# EAGLE design VestibularH2 (EAGLE 9.6.2)
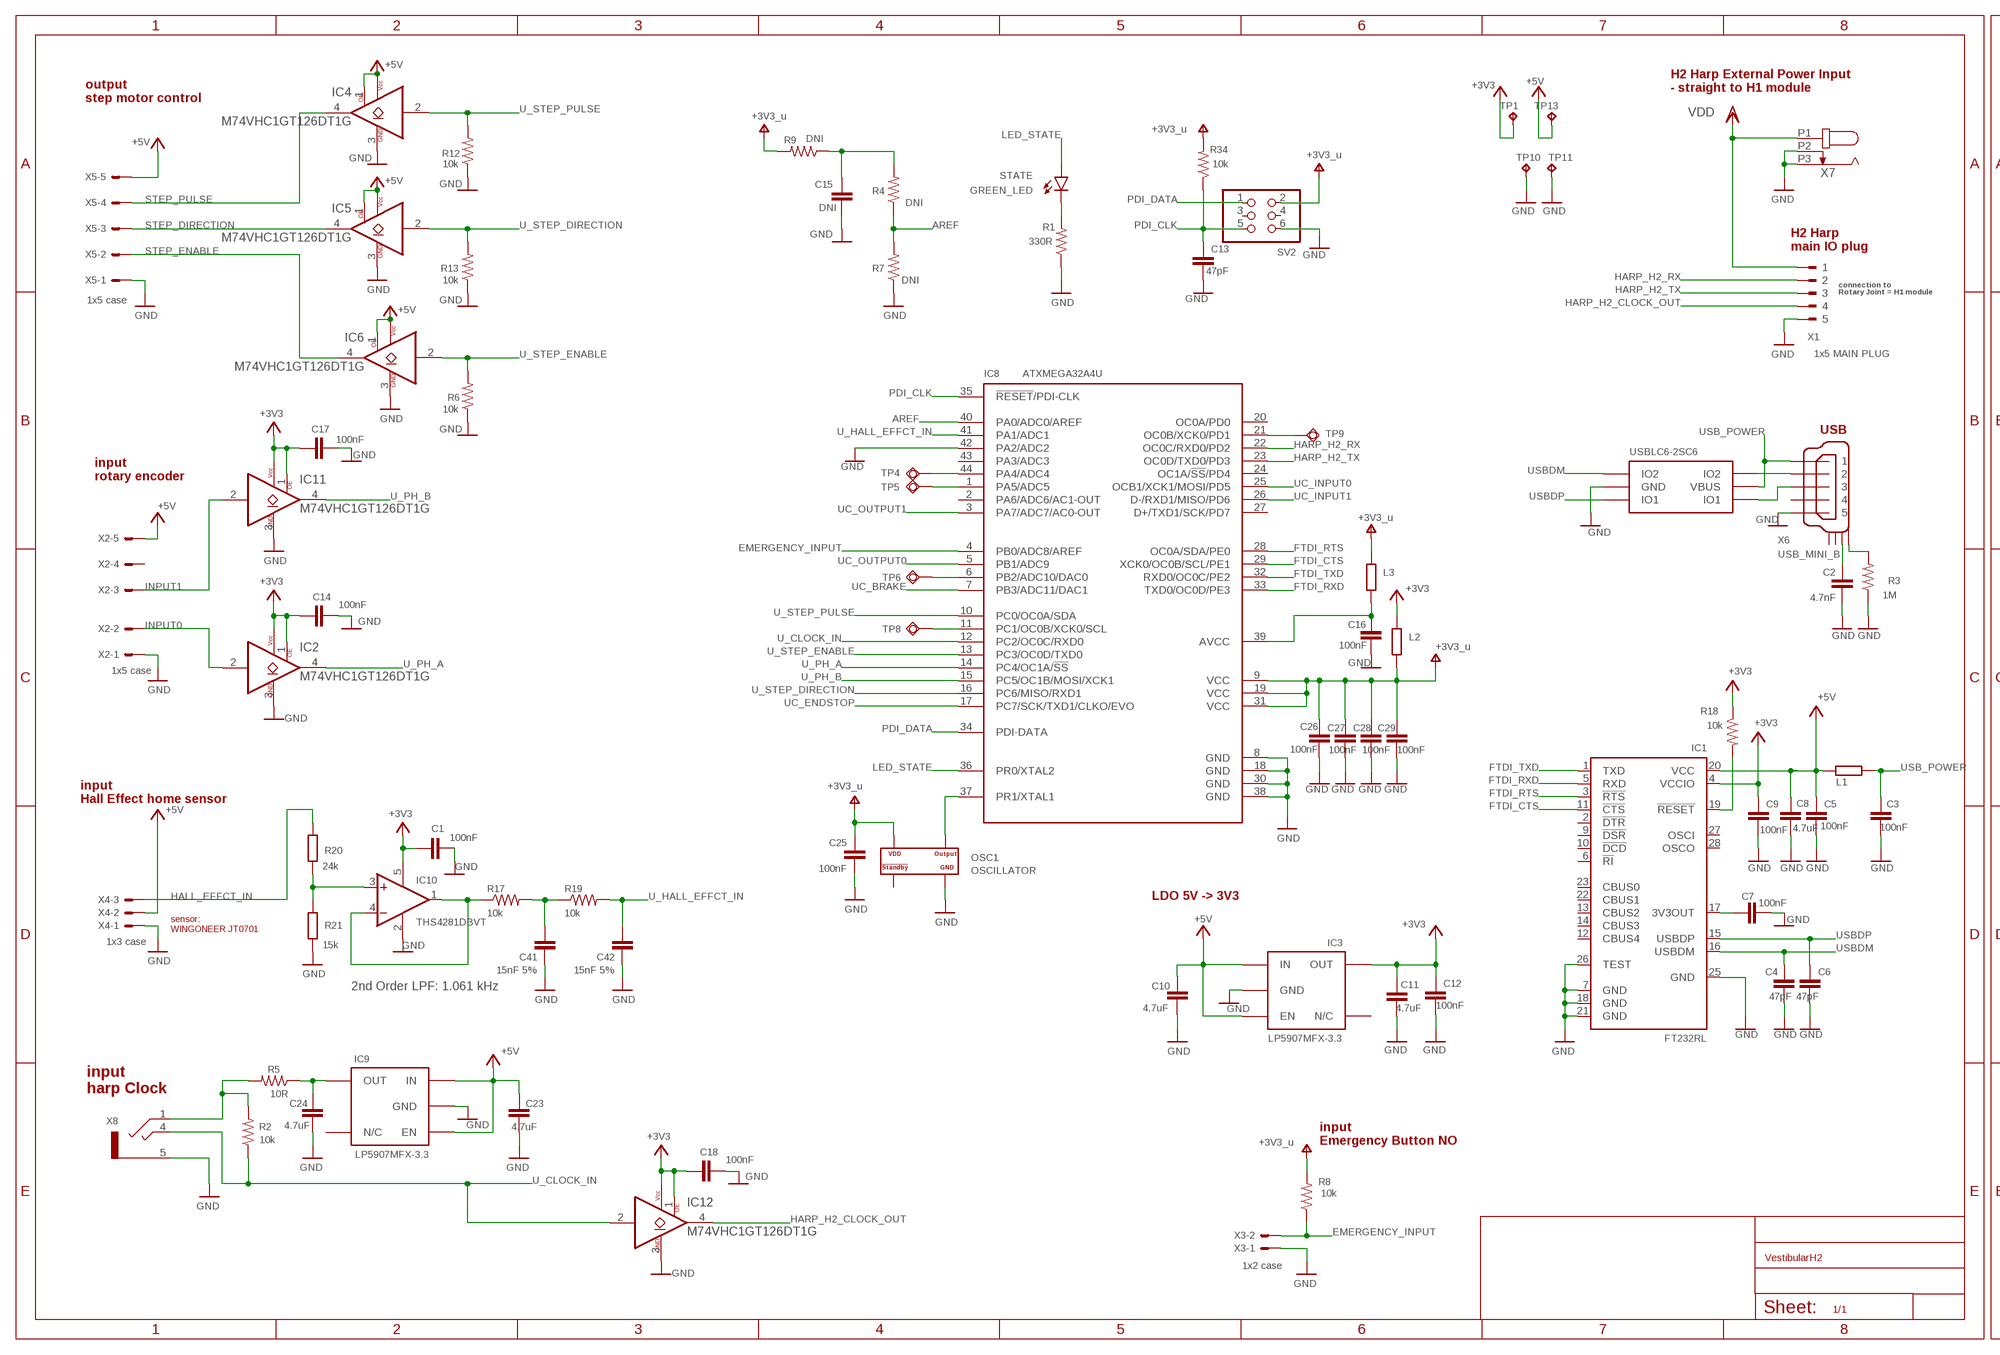
[diagram p0: schematic, sheet 1, part 1 of 2]
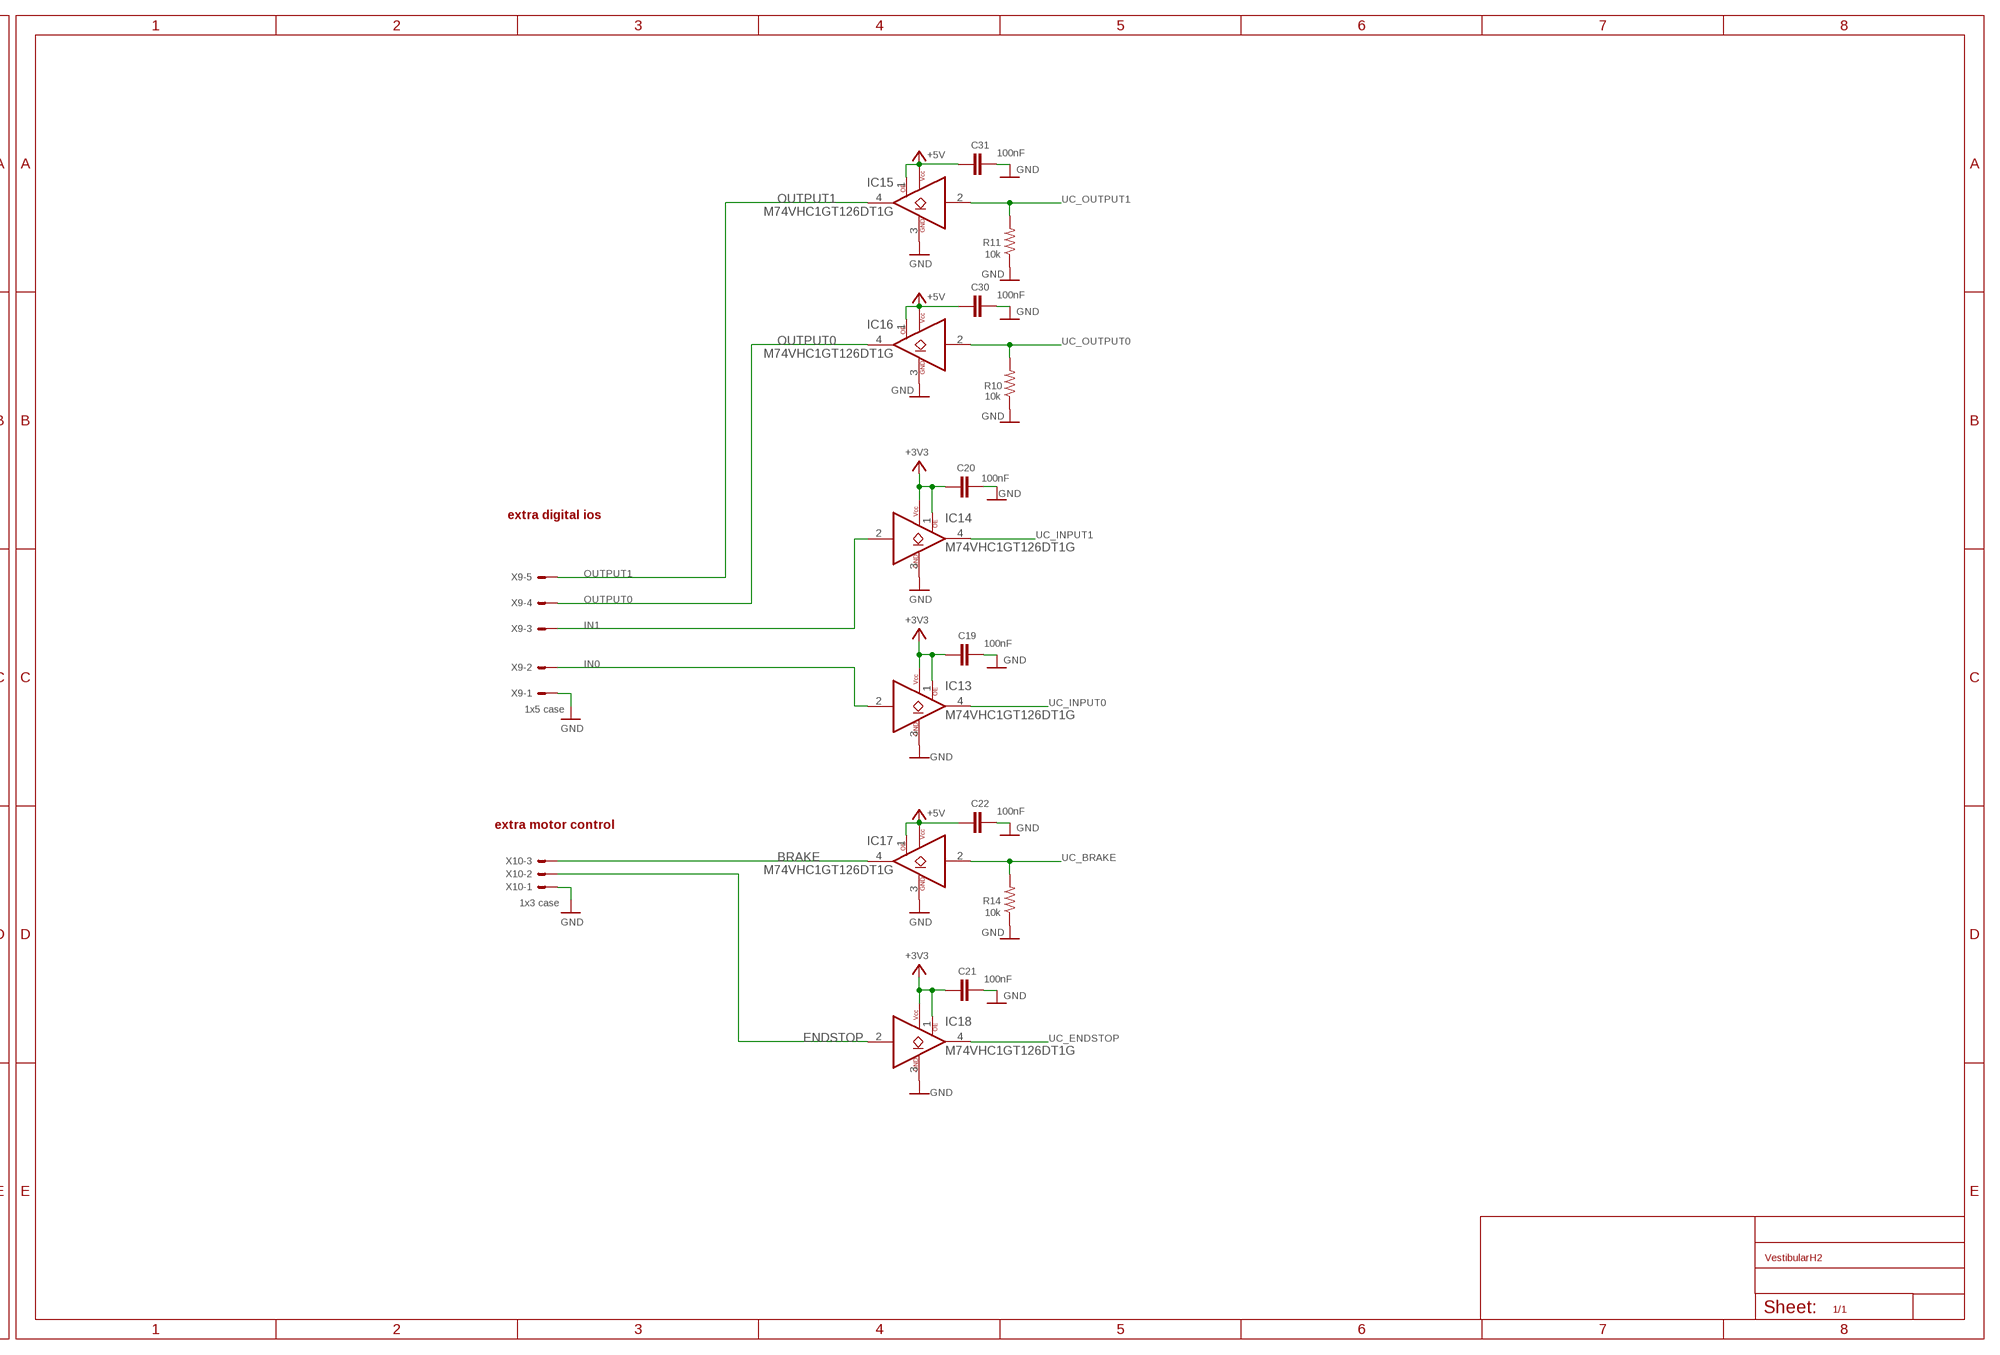
[diagram p1: schematic, sheet 1, part 2 of 2]

## Parts
C1  100nF  C-EUC0402K  [C0402K]
C2  4.7nF  C-EUC0402K  [C0402K]
C3  100nF  C-EUC0402K  [C0402K]
C4  47pF  C-EUC0402K  [C0402K]
C5  100nF  C-EUC0402K  [C0402K]
C6  47pF  C-EUC0402K  [C0402K]
C7  100nF  C-EUC0402K  [C0402K]
C8  4.7uF  C-EUC0603K  [C0603K]
C9  100nF  C-EUC0402K  [C0402K]
C10  4.7uF  C-EUC0603K  [C0603K]
C11  4.7uF  C-EUC0603K  [C0603K]
C12  100nF  C-EUC0402K  [C0402K]
C13  47pF  C-EUC0402K  [C0402K]
C14  100nF  C-EUC0402K  [C0402K]
C15  DNI  C-EUC0603K  [C0603K]
C16  100nF  C-EUC0402K  [C0402K]
C17  100nF  C-EUC0402K  [C0402K]
C18  100nF  C-EUC0402K  [C0402K]
C19  100nF  C-EUC0402K  [C0402K]
C20  100nF  C-EUC0402K  [C0402K]
C21  100nF  C-EUC0402K  [C0402K]
C22  100nF  C-EUC0402K  [C0402K]
C23  4.7uF  C-EUC0603K  [C0603K]
C24  4.7uF  C-EUC0603K  [C0603K]
C25  100nF  C-EUC0402K  [C0402K]
C26  100nF  C-EUC0402K  [C0402K]
C27  100nF  C-EUC0402K  [C0402K]
C28  100nF  C-EUC0402K  [C0402K]
C29  100nF  C-EUC0402K  [C0402K]
C30  100nF  C-EUC0402K  [C0402K]
C31  100nF  C-EUC0402K  [C0402K]
C41  15nF 5%  C-EUC0402K  [C0402K]
C42  15nF 5%  C-EUC0402K  [C0402K]
IC1  FT232RL  [SSOP28]
IC2  M74VHC1GT126DT1G  [TSOP-5]
IC3  LP5907MFX-3.3  TLV700XX  [TSOT23-5]
IC4  M74VHC1GT126DT1G  [TSOP-5]
IC5  M74VHC1GT126DT1G  [TSOP-5]
IC6  M74VHC1GT126DT1G  [TSOP-5]
IC7  USBLC6-2SC6  [SOT23-6L]
IC8  ATXMEGA32A4U  XMEGA-A4_AT-XMEGA-XXA4-AUTQFP44  [TQFP44]
IC9  LP5907MFX-3.3  TLV700XX  [TSOT23-5]
IC10  THS4281DBVT  OPA365  [SOT23-5]
IC11  M74VHC1GT126DT1G  [TSOP-5]
IC12  M74VHC1GT126DT1G  [TSOP-5]
IC13  M74VHC1GT126DT1G  [TSOP-5]
IC14  M74VHC1GT126DT1G  [TSOP-5]
IC15  M74VHC1GT126DT1G  [TSOP-5]
IC16  M74VHC1GT126DT1G  [TSOP-5]
IC17  M74VHC1GT126DT1G  [TSOP-5]
IC18  M74VHC1GT126DT1G  [TSOP-5]
L1  40R@100MHz  R-EU_R0805  [R0805]
L2  40R@100MHz  R-EU_R0805  [R0805]
L3  40R@100MHz  R-EU_R0805  [R0805]
OSC1  OSCILLATOR  [OSCILLATOR_3.2X2.5]
R1  330R  R-US_R0402  [R0402]
R2  10k  R-US_R0402  [R0402]
R3  1M  R-US_R0402  [R0402]
R4  DNI  R-US_R0402  [R0402]
R5  10R  R-US_R0402  [R0402]
R6  10k  R-US_R0402  [R0402]
R7  DNI  R-US_R0402  [R0402]
R8  10k  R-US_R0402  [R0402]
R9  DNI  R-US_R0402  [R0402]
R10  10k  R-US_R0402  [R0402]
R11  10k  R-US_R0402  [R0402]
R12  10k  R-US_R0402  [R0402]
R13  10k  R-US_R0402  [R0402]
R14  10k  R-US_R0402  [R0402]
R17  10k  R-US_R0402  [R0402]
R18  10k  R-US_R0402  [R0402]
R19  10k  R-US_R0402  [R0402]
R20  24k  R-EU_R0402  [R0402]
R21  15k  R-EU_R0402  [R0402]
R34  10k  R-US_R0402  [R0402]
STATE  GREEN_LED  LEDCHIP-LED0603  [CHIP-LED0603]
SV2  PINHD-2X3  [2X03]
TP1  NO_COMPONENT  TPB1,27  [B1,27]
TP4  NO_COMPONENT  TPSQTP11R  [TP11R]
TP5  NO_COMPONENT  TPSQTP11R  [TP11R]
TP6  NO_COMPONENT  TPSQTP11R  [TP11R]
TP8  NO_COMPONENT  TPSQTP11R  [TP11R]
TP9  NO_COMPONENT  TPSQTP11R  [TP11R]
TP10  NO_COMPONENT  TPB1,27  [B1,27]
TP11  NO_COMPONENT  TPB1,27  [B1,27]
TP13  NO_COMPONENT  TPB1,27  [B1,27]
X1  1x5 MAIN PLUG  90G-5  [90G-5]
X2  1x5 case  22-23-2051  [22-23-2051]
X3  1x2 case  22-23-2021  [22-23-2021]
X4  1x3 case  22-23-2031  [22-23-2031]
X5  1x5 case  22-23-2051  [22-23-2051]
X6  USB_MINI_B  [240-0002-1]
X7  DC_JACK2.1MM  [DC_POWER_INPUT_2.1MM]
X8  CLCK_JACK  STEREO_JACK  [35RASMT2BHNTRX]
X9  1x5 case  22-23-2051  [22-23-2051]
X10  1x3 case  22-23-2031  [22-23-2031]

## Nets
+3V3: C1.1 C9.1 C11.1 C12.1 C14.1 C17.1 C18.1 C19.1 C20.1 C21.1 IC1.4(VCCIO) IC2.1(OE) IC2.5(VCC) IC3.5(OUT) IC10.5(V+) IC11.1(OE) IC11.5(VCC) IC12.1(OE) IC12.5(VCC) IC13.1(OE) IC13.5(VCC) IC14.1(OE) IC14.5(VCC) IC18.1(OE) IC18.5(VCC) L2.2 R18.1 TP1.TP
+5V: C5.1 C8.1 C10.1 C22.1 C23.1 C30.1 C31.1 IC1.20(VCC) IC3.1(IN) IC3.3(EN) IC4.1(OE) IC4.5(VCC) IC5.1(OE) IC5.5(VCC) IC6.1(OE) IC6.5(VCC) IC9.1(IN) IC9.3(EN) IC15.1(OE) IC15.5(VCC) IC16.1(OE) IC16.5(VCC) IC17.1(OE) IC17.5(VCC) L1.1 TP13.TP X2.5 X4.2 X5.5
AREF: IC8.40(PA0/ADC0/AREF) R4.1 R7.2
BRAKE: IC17.4(Y) X10.3
EMERGENCY_INPUT: IC8.4(PB0/ADC8/AREF) R8.1 X3.2
ENDSTOP: IC18.2(A) X10.2
FTDI_CTS: IC1.11(!CTS) IC8.29(XCK0/OC0B/SCL/PE1)
FTDI_RTS: IC1.3(!RTS) IC8.28(OC0A/SDA/PE0)
FTDI_RXD: IC1.5(RXD) IC8.33(TXD0/OC0D/PE3)
FTDI_TXD: IC1.1(TXD) IC8.32(RXD0/OC0C/PE2)
GND [GND class]: C1.2 C2.2 C3.2 C4.2 C5.2 C6.2 C7.2 C8.2 C9.2 C10.2 C11.2 C12.2 C13.2 C14.2 C15.2 C16.2 C17.2 C18.2 C19.2 C20.2 C21.2 C22.2 C23.2 C24.2 C25.2 C26.2 C27.2 C28.2 C29.2 C30.2 C31.2 C41.1 C42.1 IC1.7(GND) IC1.18(GND) IC1.21(GND) IC1.25(GND) IC1.26(TEST) IC2.3(GND) IC3.2(GND) IC4.3(GND) IC5.3(GND) IC6.3(GND) IC7.P$2(GND) IC8.8(GND) IC8.18(GND) IC8.30(GND) IC8.38(GND) IC8.42(PA2/ADC2) IC9.2(GND) IC10.2(V-) IC11.3(GND) IC12.3(GND) IC13.3(GND) IC14.3(GND) IC15.3(GND) IC16.3(GND) IC17.3(GND) IC18.3(GND) OSC1.P$2(GND) R1.1 R3.1 R6.1 R7.1 R10.1 R11.1 R12.1 R13.1 R14.1 R21.1 SV2.6 TP10.TP TP11.TP X1.5 X2.1 X3.1 X4.1 X5.1 X6.P$5 X7.P2 X7.P3 X8.5 X9.1 X10.1
HALL_EFFCT_IN: R20.2 X4.3
HARP_H2_CLOCK_OUT: IC12.4(Y) X1.4
HARP_H2_RX: IC8.22(OC0C/RXD0/PD2) X1.2
HARP_H2_TX: IC8.23(OC0D/TXD0/PD3) X1.3
IN0: IC13.2(A) X9.2
IN1: IC14.2(A) X9.3
INPUT0: IC2.2(A) X2.2
INPUT1: IC11.2(A) X2.3
LED_STATE: IC8.36(PR0/XTAL2) STATE.A
N$1: R3.2 X6.SHIELD_4
N$2: IC7.P$4(IO2) X6.P$2
N$3: IC7.P$6(IO1) X6.P$3
N$9: R1.2 STATE.C
N$11: IC8.44(PA4/ADC4) TP4.TP
N$12: IC8.1(PA5/ADC5) TP5.TP
N$13: IC8.6(PB2/ADC10/DAC0) TP6.TP
N$15: C2.1 X6.SHIELD_3
N$17: IC8.11(PC1/OC0B/XCK0/SCL) TP8.TP
N$18: IC8.21(OC0B/XCK0/PD1) TP9.TP
N$38: C7.1 IC1.17(3V3OUT)
N$50: C41.2 R17.2 R19.1
N$62: C15.1 R4.2 R9.1
N$63: C16.1 IC8.39(AVCC) L3.1
N$64: IC10.1(OUT) IC10.4(-IN) R17.1
N$65: IC10.3(+IN) R20.1 R21.2
N$103: R2.2 R5.2 X8.1
N$104: C24.1 IC9.5(OUT) R5.1
N$175: IC1.19(!RESET) R18.2
OSC2: IC8.37(PR1/XTAL1) OSC1.P$3(OUTPUT)
OUTPUT0: IC16.4(Y) X9.4
OUTPUT1: IC15.4(Y) X9.5
PDI_CLK: C13.1 IC8.35(!RESET!/PDI-CLK) R34.1 SV2.5
PDI_DATA: IC8.34(PDI-DATA) SV2.1
STEP_DIRECTION: IC5.4(Y) X5.3
STEP_ENABLE: IC6.4(Y) X5.2
STEP_PULSE: IC4.4(Y) X5.4
U_CLOCK_IN: IC8.12(PC2/OC0C/RXD0) IC12.2(A) R2.1 X8.4
U_HALL_EFFCT_IN: C42.2 IC8.41(PA1/ADC1) R19.2
U_PH_A: IC2.4(Y) IC8.14(PC4/OC1A/!SS)
U_PH_B: IC8.15(PC5/OC1B/MOSI/XCK1) IC11.4(Y)
U_STEP_DIRECTION: IC5.2(A) IC8.16(PC6/MISO/RXD1) R13.2
U_STEP_ENABLE: IC6.2(A) IC8.13(PC3/OC0D/TXD0) R6.2
U_STEP_PULSE: IC4.2(A) IC8.10(PC0/OC0A/SDA) R12.2
UC_BRAKE: IC8.7(PB3/ADC11/DAC1) IC17.2(A) R14.2
UC_ENDSTOP: IC8.17(PC7/SCK/TXD1/CLKO/EVO) IC18.4(Y)
UC_INPUT0: IC8.25(OCB1/XCK1/MOSI/PD5) IC13.4(Y)
UC_INPUT1: IC8.26(D-/RXD1/MISO/PD6) IC14.4(Y)
UC_OUTPUT0: IC8.5(PB1/ADC9) IC16.2(A) R10.2
UC_OUTPUT1: IC8.3(PA7/ADC7/AC0-OUT) IC15.2(A) R11.2
USB_POWER: C3.1 IC7.P$5(VBUS) L1.2 X6.P$1
USBDM: C4.1 IC1.16(USBDM) IC7.P$3(IO2)
USBDP: C6.1 IC1.15(USBDP) IC7.P$1(IO1)
V+: C25.1 C26.1 C27.1 C28.1 C29.1 IC8.9(VCC) IC8.19(VCC) IC8.31(VCC) L2.1 L3.2 OSC1.P$4(VDD) R8.2 R9.2 R34.2 SV2.2 ; supply symbol labelled +3V3_u
VDD: X1.1 X7.P1
Unconnected: IC1.2(!DTR) IC1.6(!RI) IC1.9(!DSR) IC1.10(!DCD) IC1.12(CBUS4) IC1.13(CBUS2) IC1.14(CBUS3) IC1.22(CBUS1) IC1.23(CBUS0) IC1.27(OSCI) IC1.28(OSCO) IC3.4(N/C) IC8.2(PA6/ADC6/AC1-OUT) IC8.20(OC0A/PD0) IC8.24(OC1A/!SS!/PD4) IC8.27(D+/TXD1/SCK/PD7) IC8.43(PA3/ADC3) IC9.4(N/C) OSC1.P$1(STANDBY#) SV2.3 SV2.4 X2.4 X6.P$4 X6.SHIELD_1 X6.SHIELD_2

## Notes on the sheet
- H2 Harp External Power Input
  - straight to H1 module
- output
  step motor control
- H2 Harp 
  main IO plug
- connection to 
  Rotary Joint = H1 module
- USB
- input
  rotary encoder
- extra digital ios
- input
  Hall Effect home sensor
- extra motor control
- LDO 5V -> 3V3
- sensor:
  WINGONEER JT0701
- 2nd Order LPF: 1.061 kHz
- input
  harp Clock
- input
  Emergency Button NO

## Library data of the parts
C1 C3 C5 C7 C9 C12 C14 C16-C22 C25-C31 = Harp Motor H2-module v1.0:C-EU: CAPACITOR, European symbol; MPN: C1005X7R1H104K050BB; OEPS: OEPS010004
C2 = Harp Motor H2-module v1.0:C-EU: CAPACITOR, European symbol; MPN: CC0402KRX7R8BB472; OEPS: OEPS010001
C4 C6 C13 = Harp Motor H2-module v1.0:C-EU: CAPACITOR, European symbol; MPN: 04025A470JAT2A; OEPS: OEPS010011
C8 C10 C11 C23 C24 = Harp Motor H2-module v1.0:C-EU: CAPACITOR, European symbol; MPN: C1608X6S1C475K080AC; OEPS: OEPS010018
C15 = Harp Motor H2-module v1.0:C-EU: CAPACITOR, European symbol; MPN: DNI; OEPS: DNI
C41 C42 = Harp Motor H2-module v1.0:C-EU: CAPACITOR, European symbol; MPN: CGA2B3X7R1V153K050BB; OEPS: OEPS010023
IC1 = Harp Motor H2-module v1.0:FT232R: UART/FIFO IC; MPN: FT232RL; OEPS: OEPS080013
IC2 IC4-IC6 IC11-IC18 = Harp Motor H2-module v1.0:M74VHC1GT126DT1G; DIGIKEY_PN: M74VHC1GT126DT1GOSDKR-ND; MPN: M74VHC1GT126DT1G; OEPS: OEPS080017
IC3 IC9 = Harp Motor H2-module v1.0:TLV700XX: C REG LINEAR 3.3V 200MA SOT23-5; MPN: LP5907MFX-3.3/NOPB; OEPS: OEPS080016
IC7 = Harp Motor H2-module v1.0:USBLC6-2SC6: TVS DIODE 5.25VWM 17VC SOT23-6; MPN: USBLC6-2SC6; OEPS: OEPS030010
IC8 = Harp Motor H2-module v1.0:XMEGA-A4_AT-XMEGA-XXA4-AU: ATxMega a4 Serie; MPN: ATXMEGA32A4U-AUR; OEPS: OEPS080012
IC10 = Harp Motor H2-module v1.0:OPA365; MPN: THS4281DBVT; OEPS: OEPS080038
L1-L3 = Harp Motor H2-module v1.0:R-EU_: RESISTOR, European symbol; MPN: MI0805K400R-10; OEPS: OEPS040003
OSC1 = Harp Motor H2-module v1.0:OSCILLATOR: XTAL OSC TCXO 32.0000MHZ HCMOS; MPN: DSC1001CI5-032.0000; OEPS: OEPS080018
R1 = Harp Motor H2-module v1.0:R-US_: RESISTOR, American symbol; MPN: RC0402FR-07330RL; OEPS: OEPS020037
R2 R6 R8 R10-R14 R17-R19 R34 = Harp Motor H2-module v1.0:R-US_: RESISTOR, American symbol; MPN: CRCW040210K0FKED; OEPS: OEPS020030
R3 = Harp Motor H2-module v1.0:R-US_: RESISTOR, American symbol; MPN: CRCW04021M00FKED; OEPS: OEPS020026
R4 R7 R9 = Harp Motor H2-module v1.0:R-US_: RESISTOR, American symbol; MPN: DNI; OEPS: DNI
R5 = Harp Motor H2-module v1.0:R-US_: RESISTOR, American symbol; MPN: ERJ-PA2J100X; OEPS: OEPS020041
R20 = Harp Motor H2-module v1.0:R-EU_: RESISTOR, European symbol; MPN: ERJ-2RKF2402X; OEPS: OEPS020048
R21 = Harp Motor H2-module v1.0:R-EU_: RESISTOR, European symbol; MPN: ERJ-2RKF1502X; OEPS: OEPS020015
STATE = Harp Motor H2-module v1.0:LED; MPN: LTST-C191KGKT; OEPS: OEPS030005
SV2 = Harp Motor H2-module v1.0:PINHD-2X3: PIN HEADER; MPN: 609-3210-ND; OEPS: OEPS070015
TP1 TP10 TP11 TP13 = Harp Motor H2-module v1.0:TP: Test pad
TP4-TP6 TP8 TP9 = Harp Motor H2-module v1.0:TPSQ: Test pad
X1 = Harp Motor H2-module v1.0:90G-5: WEIDMUELLER CLAMP CONNECTOR; MPN: 20.155MH/5-E; OEPS: OEPS070037
X2 X5 X9 = Harp Motor H2-module v1.0:22-23-2051: .100" (2.54mm) Center Header - 5 Pin; MPN: 282834-5; OEPS: OEPS070041
X3 = Harp Motor H2-module v1.0:22-23-2021: .100" (2.54mm) Center Header - 2 Pin; MPN: 282834-2; OEPS: OEPS070020
X4 X10 = Harp Motor H2-module v1.0:22-23-2031: .100" (2.54mm) Center Header - 3 Pin; MPN: 282834-3; OEPS: OEPS070035
X6 = Harp Motor H2-module v1.0:USB_MINI_B: CONN RCPT USB2.0 MINI B SMD R/A; MPN: UX60-MB-5S8; OEPS: OEPS070021
X7 = Harp Motor H2-module v1.0:DC_JACK: DC Power Connectors PCB 2.1MM; MPN: 163-179PH-EX; OEPS: OEPS070026
X8 = Harp Motor H2-module v1.0:STEREO_JACK: CONN JACK STEREO 3.5MM SMD R/A; MPN: 35RASMT2BHNTRX; OEPS: OEPS070025

## Net classes
0 default: clearance 0.205 mm

## Board
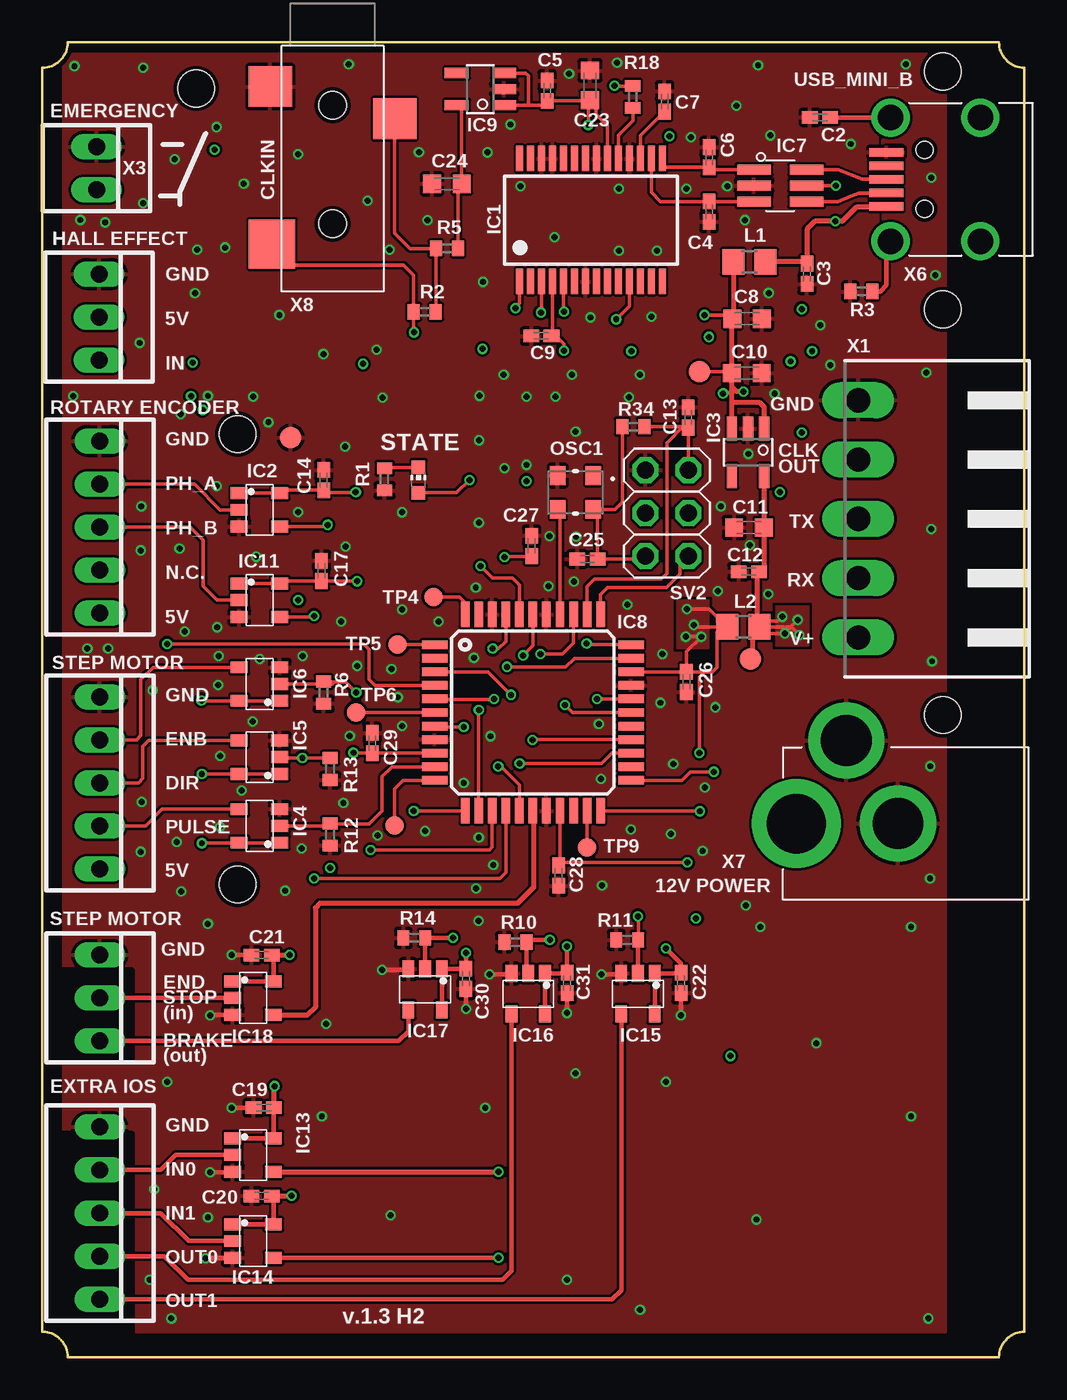
[diagram p2: board, top side]
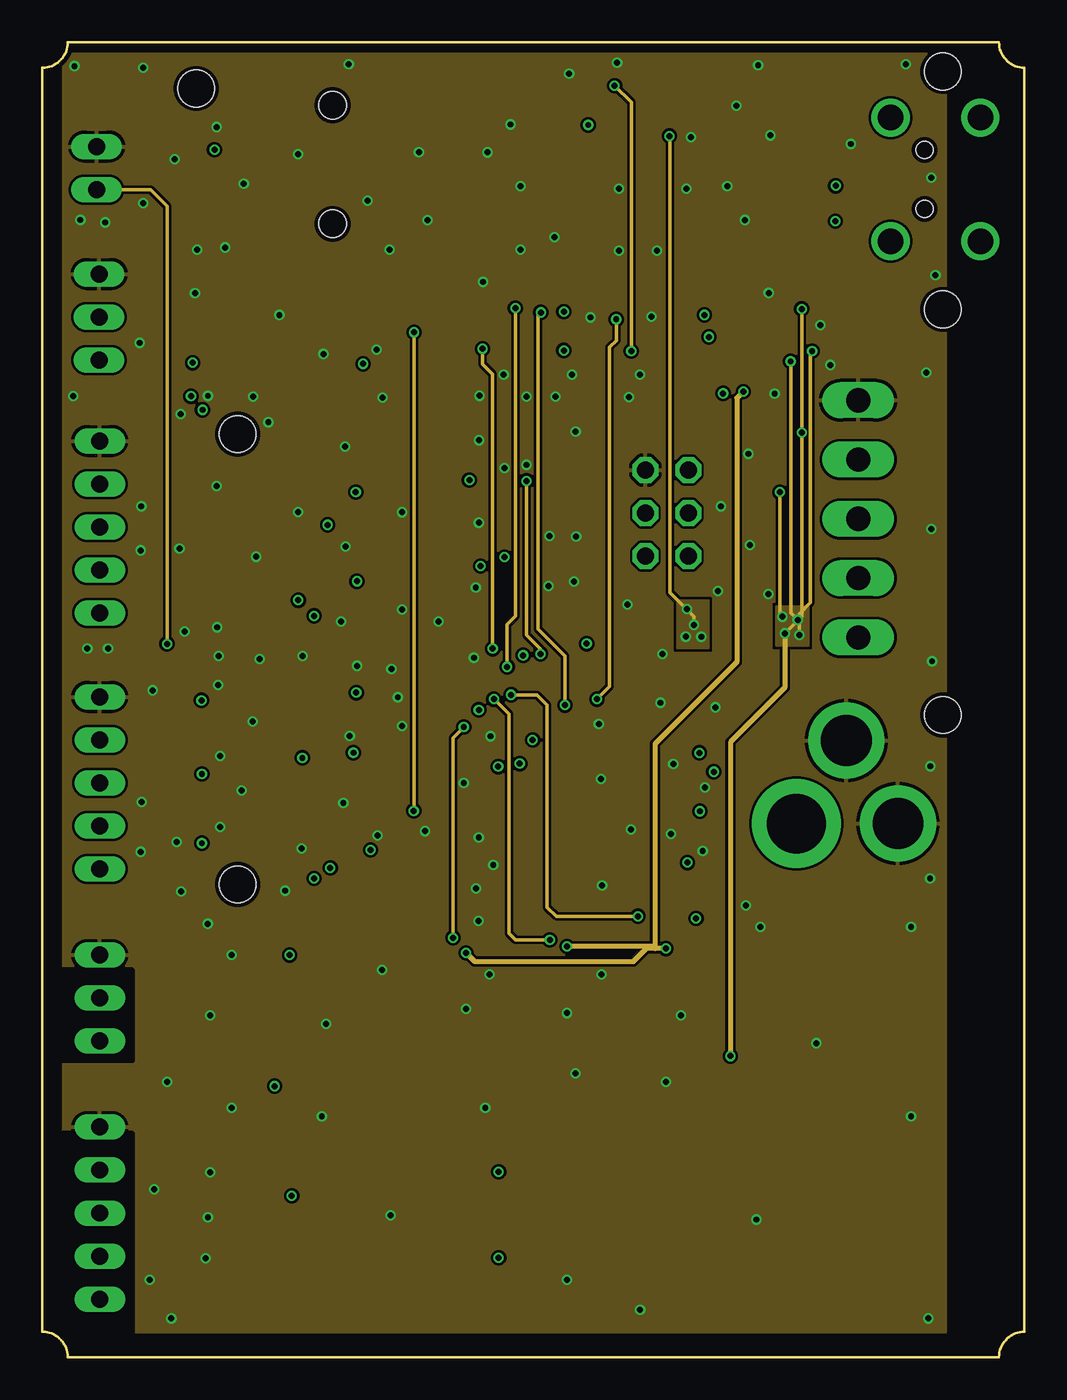
[diagram p3: board, inner layer Route2]
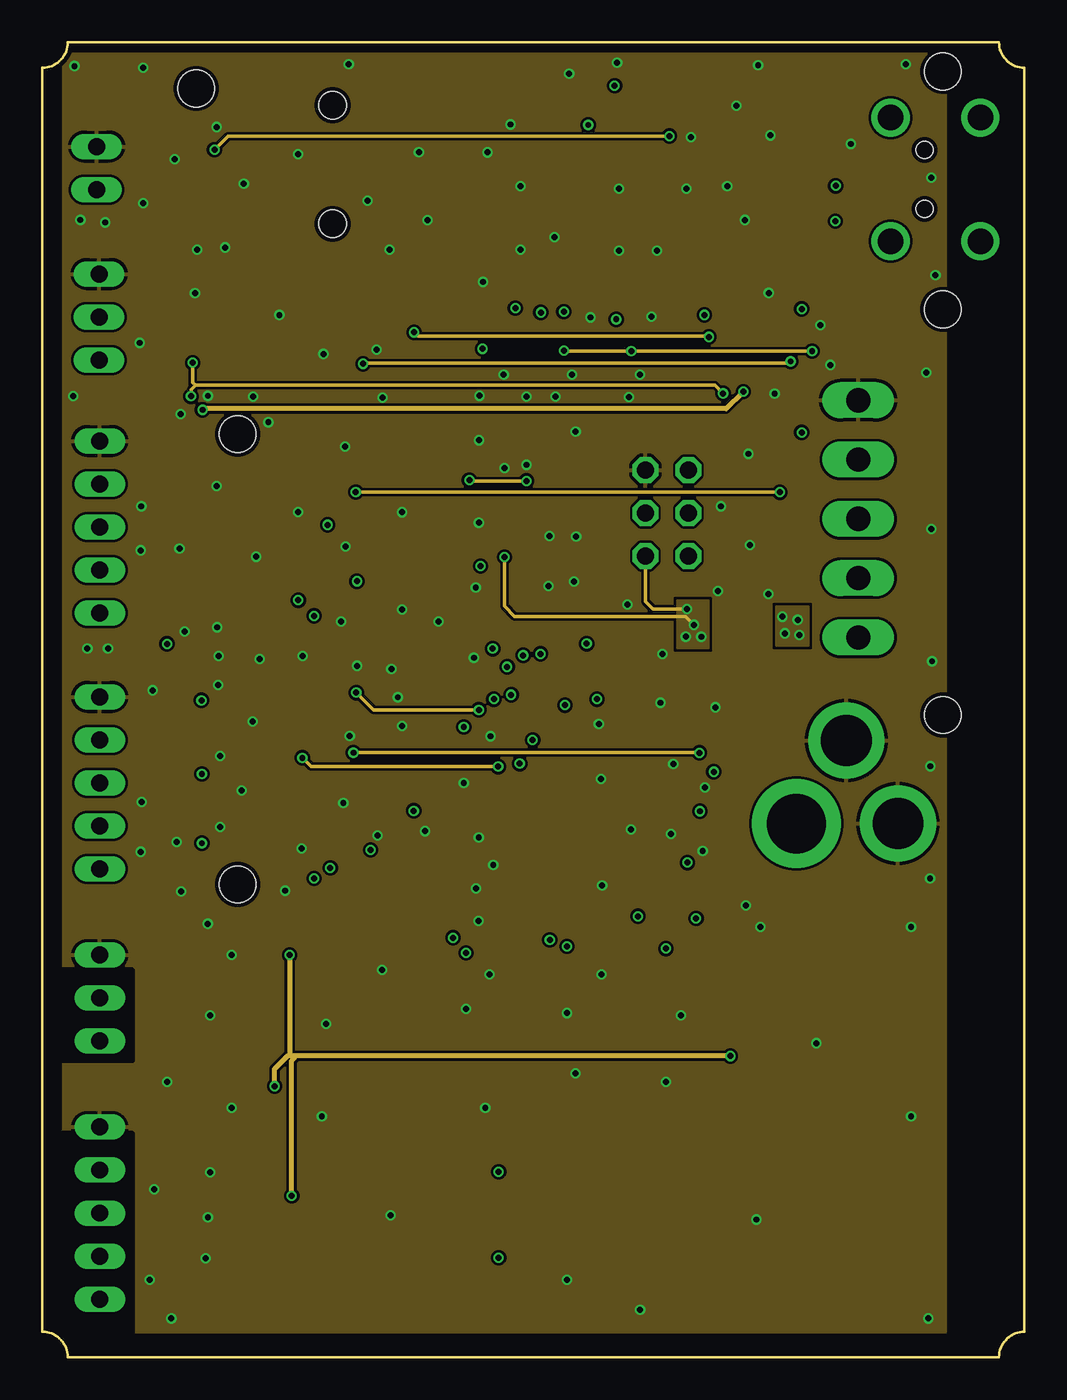
[diagram p4: board, inner layer Route15]
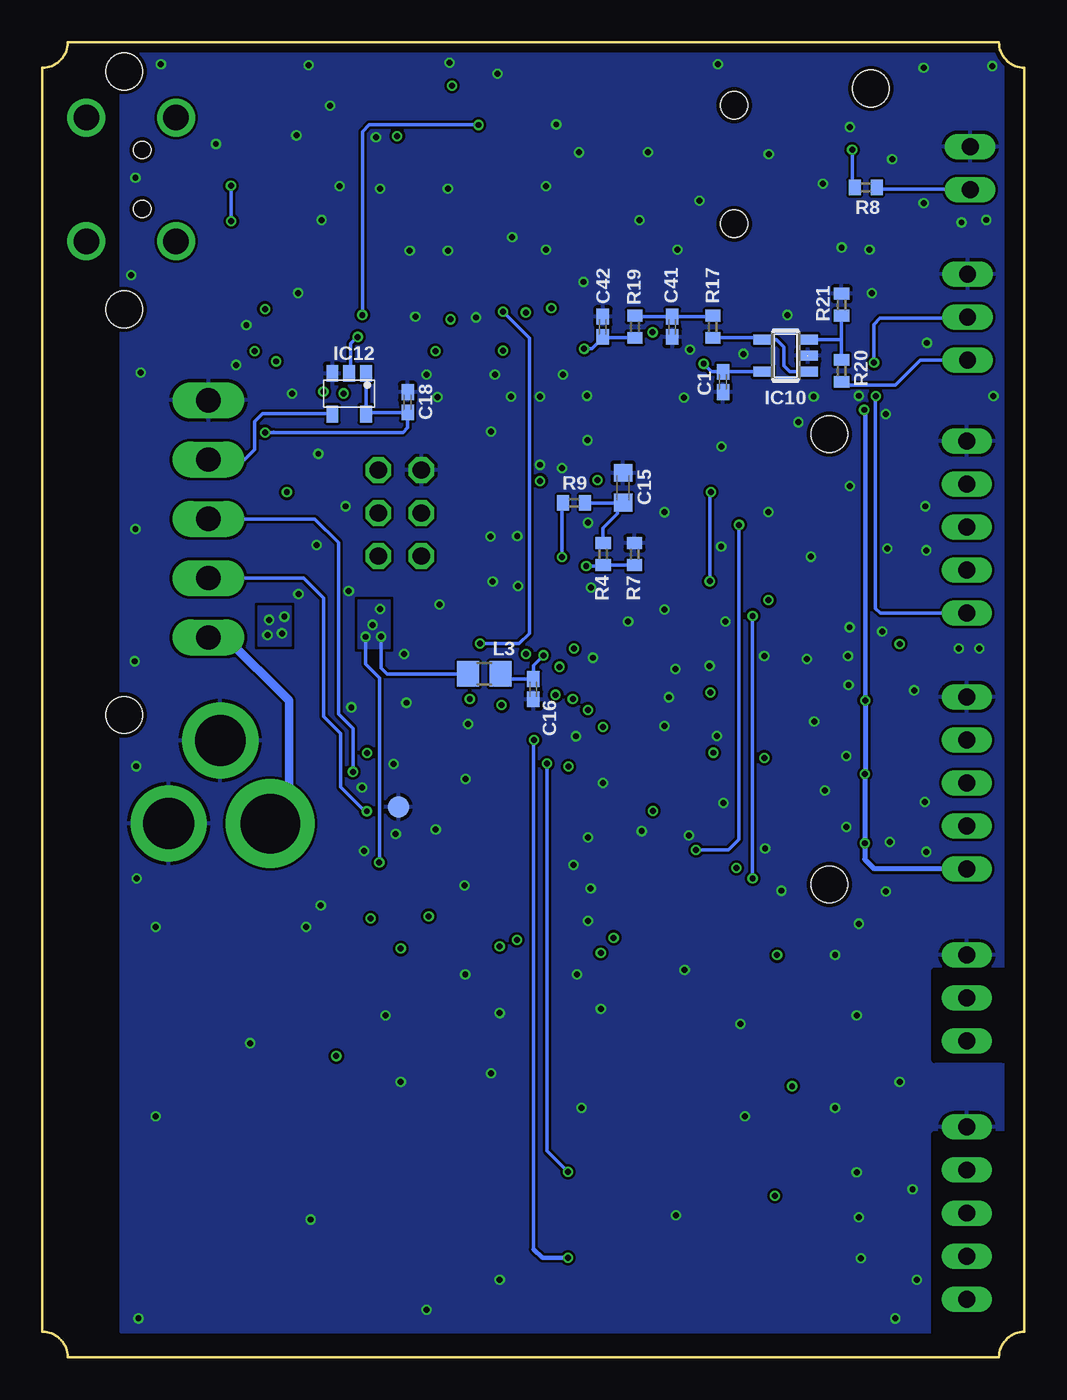
[diagram p5: board, bottom side, seen from below]

Size 58 x 77.65 mm. Coordinates in mm from the lower left corner, seen from the top.
Outline: 56.5,77.65 1.5,77.65 arc-90 0,76.15 0,1.5 arc-90 1.5,0 56.5,0 arc-90 58,1.5 58,76.15 arc-90 56.5,77.65
Copper layers (1+2*15+16): Top 0.018mm / dielectric 0.36mm / Route2 0.035mm / dielectric 0.71mm / Route15 0.035mm / dielectric 0.2mm / Bottom 0.018mm
Design rules "my design rules *": minimum track width 0.15mm, minimum drill 0.35mm, track to track 6mil, track to pad 6mil, pad to pad 6mil, via to via 6mil, smd to smd 6mil, copper to edge 0.25mm, drill to drill 0.35mm, minimum pad ring 0.175mm, minimum via ring 0.125mm, stop-mask expansion 0mil, vias tented up to drill 0.45mm, thermal gap 0.2mm
Holes 2.15 mm at 11.53,27.92 9.08,74.92 53.17,37.93 53.17,61.87 53.17,75.92 11.53,54.52

### Footprints (pad centres in the part's own frame; a part is rotated, then mirrored left to right if it is on the bottom)
C0402K = smd 0.925 x 0.74: 1 -0.6,0; 2 0.6,0
C0603K = smd 1.05 x 1.08: 1 -0.875,0; 2 0.875,0
SSOP28 = smd 0.4 x 1.5: 1 -4.225,-3.625; 2 -3.575,-3.625; 3 -2.925,-3.625; 4 -2.275,-3.625; 5 -1.625,-3.625; 6 -0.975,-3.625; 7 -0.325,-3.625; 8 0.325,-3.625; 9 0.975,-3.625; 10 1.625,-3.625; 11 2.275,-3.625; 12 2.925,-3.625; 13 3.575,-3.625; 14 4.225,-3.625; 15 4.225,3.625; 16 3.575,3.625; 17 2.925,3.625; 18 2.275,3.625; 19 1.625,3.625; 20 0.975,3.625; 21 0.325,3.625; 22 -0.325,3.625; 23 -0.975,3.625; 24 -1.625,3.625; 25 -2.275,3.625; 26 -2.925,3.625; 27 -3.575,3.625; 28 -4.225,3.625
TSOP-5 = smd 0.7 x 1: 1 -0.99,-1.2; 2 0,-1.2; 3 0.99,-1.2; 4 0.99,1.2; 5 -0.99,1.2
TSOT23-5 = smd 0.6 x 1.408: 1 -0.95,-1.404; 2 0,-1.404; 3 0.95,-1.404; 4 0.95,1.404; 5 -0.95,1.404
SOT23-6L = smd 0.6 x 2: P$1 -0.95,-1.55; P$2 0,-1.55; P$3 0.95,-1.55; P$4 0.95,1.55; P$5 0,1.55; P$6 -0.95,1.55
TQFP44 = smd 1.5 x 0.5: 1 -5.8,4; 2 -5.8,3.2; 3 -5.8,2.4; 4 -5.8,1.6; 5 -5.8,0.8; 6 -5.8,0; 7 -5.8,-0.8; 8 -5.8,-1.6; 9 -5.8,-2.4; 10 -5.8,-3.2; 11 -5.8,-4; 23 5.8,-4; 24 5.8,-3.2; 25 5.8,-2.4; 26 5.8,-1.6; 27 5.8,-0.8; 28 5.8,0; 29 5.8,0.8; 30 5.8,1.6; 31 5.8,2.4; 32 5.8,3.2; 33 5.8,4 | smd 0.5 x 1.5: 12 -4,-5.8; 13 -3.2,-5.8; 14 -2.4,-5.8; 15 -1.6,-5.8; 16 -0.8,-5.8; 17 0,-5.8; 18 0.8,-5.8; 19 1.6,-5.8; 20 2.4,-5.8; 21 3.2,-5.8; 22 4,-5.8; 34 4,5.8; 35 3.2,5.8; 36 2.4,5.8; 37 1.6,5.8; 38 0.8,5.8; 39 0,5.8; 40 -0.8,5.8; 41 -1.6,5.8; 42 -2.4,5.8; 43 -3.2,5.8; 44 -4,5.8
SOT23-5 = smd 0.6 x 1.2: 1 -0.95,-1.306; 2 0,-1.306; 3 0.95,-1.306; 4 0.95,1.306; 5 -0.95,1.306
R0805 = smd 1.3 x 1.5: 1 -0.95,0; 2 0.95,0
OSCILLATOR_3.2X2.5 = smd 0.9 x 1.1: P$1 -1.05,-1; P$2 1.05,-1; P$3 1.05,1; P$4 -1.05,1
R0402 = smd 0.7 x 0.9: 1 -0.65,0; 2 0.65,0
CHIP-LED0603 = smd 0.8 x 0.8: A 0,-0.75; C 0,0.75
2X03 = drill 1.016 octagon: 1 -2.54,-1.27; 2 -2.54,1.27; 3 0,-1.27; 4 0,1.27; 5 2.54,-1.27; 6 2.54,1.27
B1,27 = smd 1.27 x 1.27: TP 0,0
TP11R = smd 1.1 x 1.1: TP 0,0
90G-5 = drill 1.422 long: 1 -7,5.25; 2 -3.5,5.25; 3 0,5.25; 4 3.5,5.25; 5 7,5.25
22-23-2051 = drill 1 long: 1 -5.08,0; 2 -2.54,0; 3 0,0; 4 2.54,0; 5 5.08,0
22-23-2021 = drill 1 long: 1 -1.27,0; 2 1.27,0
22-23-2031 = drill 1 long: 1 -2.54,0; 2 0,0; 3 2.54,0
240-0002-1 = smd 0.5 x 2: P$1 -1.6,8.65; P$2 -0.8,8.65; P$3 0,8.65; P$4 0.8,8.65; P$5 1.6,8.65 | drill 1.5: SHIELD_1 -3.65,3.1; SHIELD_2 3.65,3.1; SHIELD_3 3.65,8.4; SHIELD_4 -3.65,8.4 | hole 1: -1.75,6.4; 1.75,6.4
DC_POWER_INPUT_2.1MM = drill 3.5: P1 8.5,0 | drill 3: P2 2.5,0; P3 5.55,-4.9
35RASMT2BHNTRX = smd 2.4 x 2.55: 1 0.8,3.675; 5 -1.1,-3.675 | smd 2.9 x 2.75: 4 8.2,-3.575 | hole 1.6: 0,0; 7,0

### Placement (x,y rotation side)
C1  17.8,57.59 270 bottom
C2  45.93,73.21 180 top
C3  45.16,63.98 270 top
C4  39.38,67.65 270 top
C5  29.82,74.79 90 top
C6  39.38,70.85 90 top
C7  36.75,74.15 90 top
C8  41.63,61.32 0 top
C9  29.48,60.31 180 top
C10  41.61,58.11 0 top
C11  41.74,48.99 180 top
C12  41.73,46.39 180 top
C13  38.14,55.49 90 top
C14  16.61,51.79 90 top
C15  23.7,51.35 90 bottom
C16  29,39.45 270 bottom
C17  16.49,46.43 90 top
C18  36.42,56.39 90 bottom
C19  13.08,14.73 180 top
C20  12.95,9.53 180 top
C21  12.95,23.75 180 top
C22  37.72,22.1 270 top
C23  32.35,75.1 90 top
C24  23.9,69.29 180 top
C25  32.2,47.13 180 top
C26  38.04,39.88 270 top
C27  28.89,47.91 90 top
C28  30.49,28.44 270 top
C29  19.49,36.27 90 top
C30  25.02,22.35 270 top
C31  30.99,22.1 270 top
C41  20.8,60.85 90 bottom
C42  24.9,60.85 270 bottom
IC1  32.4,67.15 0 top
IC2  12.83,50.04 270 top
IC3  41.69,53.44 180 top
IC4  12.83,31.37 90 top
IC5  12.83,35.43 90 top
IC6  12.83,39.75 90 top
IC7  43.59,69.19 270 top
IC8  28.97,38.07 0 top
IC9  25.88,74.88 90 top
IC10  14.1,59.15 90 bottom
IC11  12.83,44.7 270 top
IC12  39.88,56.9 180 bottom
IC13  12.45,11.94 270 top
IC14  12.45,6.86 270 top
IC15  35.18,21.46 180 top
IC16  28.7,21.46 180 top
IC17  22.61,21.72 180 top
IC18  12.45,21.21 270 top
L1  41.75,64.68 0 top
L2  41.41,43.12 0 top
L3  31.9,40.35 180 bottom
OSC1  31.49,51.06 180 top
R1  20.21,51.84 90 top
R2  22.58,61.73 0 top
R3  48.37,62.93 0 top
R4  24.88,47.42 90 bottom
R5  23.9,65.48 180 top
R6  16.61,39.24 90 top
R7  23.02,47.42 270 bottom
R8  9.37,69.08 180 bottom
R9  26.6,50.45 180 bottom
R10  27.94,24.51 0 top
R11  34.54,24.64 0 top
R12  16.99,30.86 90 top
R13  16.99,34.73 90 top
R14  21.97,24.77 0 top
R17  18.4,60.85 90 bottom
R18  34.87,74.42 270 top
R19  23,60.85 270 bottom
R20  10.8,58.25 270 bottom
R21  10.8,62.15 270 bottom
R34  34.91,54.95 180 top
STATE  22.21,51.8 0 top
SV2  36.89,49.85 90 top
TP1  41.83,41.23 0 top
TP4  23.11,44.9 0 top
TP5  20.99,42.08 0 top
TP6  18.52,38.07 0 top
TP8  20.79,31.39 0 top
TP9  32.16,30.1 180 top
TP10  14.67,54.3 0 top
TP11  36.97,32.48 0 bottom
TP13  38.81,58.21 0 top
X1  53.44,49.51 90 top
X2  3.4,49.02 270 top
X3  3.2,70.22 270 top
X4  3.36,61.42 270 top
X5  3.4,33.91 270 top
X6  58.5,69.55 90 top
X7  53.04,31.51 180 top
X8  17.14,73.93 270 top
X9  3.4,8.51 270 top
X10  3.4,21.21 270 top

### Tracks (layer width: path | path; a pad name or v marks a point on that pad's centre or on a via)
+3V3  (via drill 0.35)
  Top 0.203: IC1.4 30.13,60.36 C9.1 30.33,60.31 30.8,59.83 v30.8,59.45 | v18.58,45.82 16.49,45.82 C17.1 14.17,45.83 IC11.5 IC11.1 | v18.51,51.09 18.51,51.07 16.74,51.07 C14.1 14.19,51.19 IC2.5 IC2.1 | R18.1 33.81,75.07 v33.8,75.08 | v43.7,43.73 43.45,43.47 42.94,43.47 42.36,42.89 L2.2 | L2.2 42.64,42.75 v43.85,42.75 44.23,43.12 v44.7,42.65 | v44.61,43.54 44.2,43.12 L2.2
  Top 0.254: IC13.1 IC13.5 13.65,14.7 C19.1 | IC14.1 IC14.5 13.65,9.25 C20.1 | IC18.1 IC18.5 13.65,23.66 C21.1
  Top 0.305: IC3.5 42.61,51.98 C11.1 42.6,48.98 42.6,46.66 C12.1 42.2,46.26 42.2,43.29 L2.2 41.93,42.69 41.93,41.33 TP1.TP | C19.1 13.68,15.97 v13.72,16 | C20.1 v14.73,9.53 | C21.1 v14.61,23.75
  Route2 0.203: v33.8,75.08 34.78,74.1 v34.78,59.41 | v43.56,51.08 43.56,43.73 v43.7,43.73 | v44.85,61.9 v44.85,54.61 44.85,43.75 v43.85,42.75 | v45.47,59.41 45.37,59.31 45.37,44.56 44.7,43.9 v44.7,42.65 | v44.2,58.8 44.2,43.96 v44.61,43.54
  Route2 0.305: v43.85,42.75 43.85,39.53 40.64,36.32 v40.64,17.78
  Route15 0.15: v18.51,51.09 v18.52,51.1
  Route15 0.203: v18.94,58.66 18.98,58.7 44.09,58.7 v44.2,58.8 | v18.52,51.1 43.54,51.1 v43.56,51.08 | v30.8,59.45 30.83,59.41 v34.78,59.41 v45.47,59.41
  Route15 0.305: v13.72,16 13.72,17.02 14.48,17.78 14.99,17.78 | v40.64,17.78 14.99,17.78 | v14.73,9.53 14.73,17.53 14.86,17.65 | 14.86,17.65 14.99,17.78 | v14.61,23.75 14.61,17.91 14.86,17.65
  Bottom 0.2: 37.34,55.79 37.91,55.79
  Bottom 0.203: v18.51,51.09 18.58,51.02 v18.58,45.82 | v18.94,58.66 18.47,58.19 C1.1 IC10.5 | 37.34,55.79 C18.1 36.42,54.89 36.7,54.61 44.32,54.61 44.33,54.62 44.34,54.61 v44.85,54.61 | 37.91,55.79 38.89,55.79 IC12.5 IC12.1
  pour Top: 43.35,42.04 45.23,42.04 45.23,44.33 43.35,44.33
  pour Route2: 43.35,42.04 45.23,42.04 45.23,44.33 43.35,44.33
  pour Route15: 43.35,42.04 45.23,42.04 45.23,44.33 43.35,44.33
  pour Bottom: 43.35,42.04 45.23,42.04 45.23,44.33 43.35,44.33
+5V  (via drill 0.35)
  Top 0.203: IC9.1 28.7,73.93 | 28.7,73.93 29.56,73.93 C5.1 32.28,74.19 C23.1 | C23.1 32.24,74.15 v32.24,72.77 | IC1.20 33.38,72.72 32.68,73.41 32.68,73.91 C23.1 | C8.1 40.55,61.55 v39.1,61.55 | IC9.3 28.54,75.83 28.7,75.67 28.7,73.93 | TP13.TP 40.64,58.21 C10.1 | 40.73,57.28 40.73,57.15 40.5,56.91 v40.21,56.91 | IC6.1 IC6.5 9.42,38.76 v9.4,38.79 | v9.42,34.44 IC5.5 IC5.1 | v9.42,30.35 9.45,30.38 IC4.5 IC4.1
  Top 0.254: IC16.5 IC16.1 30.95,22.66 C31.1 v30.99,24.26 | IC15.5 IC15.1 37.68,22.66 C22.1 37.72,23.24 v36.83,24.13 | IC17.5 IC17.1 24.98,22.92 C30.1 v25.02,23.88
  Top 0.305: L1.1 40.8,61.2 40.75,61.2 C8.1 40.73,61.28 C10.1 40.73,57.28 | IC3.3 40.73,56.36 | 40.73,56.36 40.73,57.28 | IC3.1 42.63,56.11 42.38,56.36 40.73,56.36 | v41.4,57.02 40.99,57.02 40.73,57.28
  Route2 0.305: v41.4,57.02 41.02,56.64 41.02,41.05 36.2,36.22 36.2,24.26 | v36.83,24.13 36.2,24.13 | 36.2,24.13 35.69,24.13 34.92,23.37 25.53,23.37 v25.02,23.88 | 36.2,24.26 v30.99,24.26 | 36.2,24.26 36.2,24.13
  Route15 0.203: v40.21,56.91 39.73,57.39 9.05,57.39 | 9.05,57.39 8.88,57.56 v8.88,58.72 | v8.78,56.75 8.78,57.12 9.05,57.39
  Route15 0.305: v41.4,57.02 40.39,56.01 9.53,56.01 v9.46,55.94
  Bottom 0.2: 8.52,61.35 3.43,61.35
  Bottom 0.203: v39.1,61.55 39.1,72.38 38.71,72.77 v32.24,72.77 | v8.78,56.75 v8.79,56.74 8.79,44.22 8.51,43.94 X2.5 | v8.88,58.72 8.88,60.99 8.52,61.35 | 3.43,61.35 X4.2
  Bottom 0.254: v9.39,38.79 9.4,53.59 9.4,55.88 v9.46,55.94
  Bottom 0.305: X5.5 8.86,28.83 9.42,29.39 v9.42,30.35 v9.42,34.44 9.4,34.47 v9.4,38.79 v9.39,38.79
AREF  (via drill 0.35)
  Top 0.203: IC8.40 28.19,43.89 28.19,45.61 27.78,46.02 26.58,46.02 v25.88,46.72
  Bottom 0.203: R7.2 R4.1 | R4.1 | v25.88,46.72 24.92,46.72 R4.1
BRAKE
  Top 0.254: X10.3 21.04,18.67 21.62,19.25 IC17.4
EMERGENCY_INPUT  (via drill 0.35)
  Top 0.203: IC8.4 19.64,39.67 19.3,40.01 19.3,41.78 18.97,42.12 v7.37,42.12
  Route2 0.203: v7.37,42.12 7.37,67.98 6.39,68.95 X3.2
  Bottom 0.203: X3.2 3.23,68.98 8.62,68.98 R8.1
ENDSTOP
  Top 0.254: X10.2 IC18.2
FTDI_CTS  (via drill 0.35)
  Top 0.203: IC1.11 34.68,62.08 33.9,61.3 v33.9,61.29 | IC8.29 32.76,38.87 v32.75,38.86
  Route2 0.203: v32.75,38.86 33.5,39.61 33.5,59.65 33.9,60.04 v33.9,61.29
FTDI_RTS  (via drill 0.35)
  Top 0.203: IC1.3 29.48,61.75 29.43,61.71 v29.45,61.7 | v30.87,38.5 31.31,38.07 IC8.28
  Route2 0.203: v29.45,61.7 29.27,61.52 29.27,43 30.87,41.4 v30.87,38.5
FTDI_RXD  (via drill 0.35)
  Top 0.203: IC1.5 30.78,61.77 v30.8,61.75 | IC8.33 32.22,42.07 v32.15,42.14
  Bottom 0.203: v32.15,42.14 29.85,42.14 29.24,42.75 29.24,60.19 v30.8,61.75
FTDI_TXD  (via drill 0.35)
  Top 0.203: IC1.1 28.18,62.26 27.91,61.99 v27.94,61.95 | v27.45,40.77 v27.45,40.76 30.91,40.76 31.42,41.27 IC8.32
  Route2 0.203: v27.45,40.77 27.45,43.27 27.94,43.76 v27.94,61.95
GND  (via drill 0.35)
  Top 0.254: C19.2 v11.18,14.73 | IC13.3 11.22,10.92 v9.91,10.92 | IC18.3 9.93,20.22 v9.91,20.19 | C21.2 v11.18,23.75 | C31.2 v30.99,20.32 | C22.2 v37.72,20.19 | IC17.3 21.56,22.86 v20.07,22.86 | C30.2 v25.02,20.57 | IC16.3 27.66,22.61 v26.42,22.61 | IC15.3 34.13,22.61 v33.02,22.61
  Top 0.305: IC14.3 11.22,5.84 v9.65,5.84
  other vias: 1.82,56.76 42.28,76.3 52.43,28.26 24.89,33.91 36.63,41.53 31.5,54.67 31.53,48.45 27.3,52.5 40.45,69.15 36.5,38.65 25.76,25.77 14.35,27.55 33.06,27.86 33,34.15 25.48,41.3 5.8,47.65 38.05,69 33.95,76.45 31.12,75.78 27.65,72.8 18.1,76.35 15.1,71.05 5.95,76.15 2.25,67.16 17.89,53.77 20.5,65.4 22.74,67.14 28.25,65.4 28.25,69.15 30.25,66.15 36.3,65.35 45.95,60.95 52.2,58.15 52.75,63.9 43.25,56.9 52.55,41.1 34.77,31.16 15.31,30.04 11.78,33.47 12.41,37.53 5.88,32.78 10.32,43.1 3.71,67.01 34.65,56.7 28.6,56.72 21,38.97 21.25,37.28 17.78,32.73 18.16,36.69 3.88,41.85 20.61,40.65 12.62,47.27 39.75,38.38 34.55,44.45 52.5,48.9 41.8,47.95 28.6,52.7 8.4,42.86 40.08,50.25 41.55,26.68 52.45,34.9 39,29.9 37.13,30.9 39.13,33.64 21.25,44.15 21.25,49.9 30.32,56.72 13.35,55.21 5.75,59.9 7.81,70.75 5.95,68.15 31.4,45.8 26.47,36.67 32.86,37.39 9.02,62.84 8.17,55.7 32.38,61.4 35.97,61.45 19.2,68.3 22.24,71.15 11.9,69.3 19.75,59.5 41,73.9 52.5,69.65 34.05,69 34.05,65.35 38.3,72.05 42.9,62.85 41.5,67.15 37.26,35.03 51,76.35 47.75,71.65 42.99,72.15 46.55,58.6 10.3,72.65 1.9,76.25 8.1,47.75 12.84,41.23 10.3,51.45 25.83,56.77 25.8,54.15 20.1,56.67 25.6,45.45 26.63,29.07 18.59,40.83 39.9,45.25 41.7,53.35 29.95,48.5 14,61.55 29.9,45.55 26.3,71.15 16.6,59.25 27.25,58.02 31.27,58.02 35.3,58.02 8.19,27.51 5.8,29.85 9.77,25.6 5.85,50.25 22.6,31.07 23.4,43.45 26.04,63.5 9.78,56.77 42.88,45.06 25.78,30.68 6.51,39.38 7.94,30.43 25.78,49.28 9.14,65.41 10.79,65.53 19.81,30.81 12.45,56.72 17.65,43.43 15.11,49.91 17.91,47.88 15.37,41.4 10.41,41.4 10.51,31.31 10.51,35.5 10.38,39.69 9.78,8.26 25.61,27.67 20.57,8.38 52.32,2.29 35.31,2.79 30.99,4.57 7.37,16.26 51.31,25.4 31.5,16.76 42.42,25.4 36.83,16.26 51.31,14.22 42.16,8.13 26.16,14.73 16.51,14.22 7.62,2.29 2.66,41.85 45.72,18.54 6.6,9.91 6.35,4.57 16.76,19.69
  pour Top (rank 5): 1.27,1.5 53.34,1.5 53.34,76.96 1.27,76.96
  pour Bottom (rank 5): 1.27,1.5 53.34,1.5 53.34,76.96 1.27,76.96
  pour Route2 (rank 5): 1.27,1.5 53.34,1.5 53.34,76.96 1.27,76.96
  pour Route15 (rank 5): 1.27,1.5 53.34,1.5 53.34,76.96 1.27,76.96
GND1  (via drill 0.35)
  other vias: 15.11,44.7
GND2  (via drill 0.35)
  other vias: 17,28.89
HALL_EFFCT_IN
  Bottom 0.203: R20.2 10.61,57.4 7.63,57.4 6.16,58.88 X4.3
HARP_H2_CLOCK_OUT
  Bottom 0.203: X1.4 46.05,53.01 45.47,53.59 45.47,55.25 44.99,55.72 40.87,55.72 IC12.4
HARP_H2_RX  (via drill 0.35)
  Top 0.203: v38.84,32.24 38.81,32.27 IC8.22
  Bottom 0.203: X1.2 42.58,46.01 41.4,44.83 41.4,37.85 40.39,36.84 40.39,33.66 38.97,32.24 v38.84,32.24
HARP_H2_TX  (via drill 0.35)
  Top 0.203: v39.66,34.57 38.29,34.57 37.78,34.06 34.78,34.06 IC8.23
  Bottom 0.203: X1.3 41.91,49.51 40.51,48.1 40.51,37.98 39.66,37.14 v39.66,34.57
IN0
  Top 0.254: X9.2 6.99,11.05 7.87,11.94 IC13.2
IN1
  Top 0.254: X9.3 6.99,8.51 8.64,6.86 IC14.2
INPUT0
  Top 0.203: X2.2 8.99,51.56 10.51,50.04 IC2.2
INPUT1
  Top 0.203: X2.3 8.73,49.02 9.5,48.25 9.5,45.55 10.33,44.71 11.62,44.71 IC11.2
LED_STATE  (via drill 0.35)
  Top 0.203: IC8.36 31.37,42.18 30.73,41.53 v29.43,41.53 | v25.22,51.79 24.48,51.05 STATE.A
  Route2 0.203: v29.43,41.53 29.43,41.83 28.6,42.66 v28.6,51.75
  Route15 0.203: v28.6,51.75 25.27,51.75 v25.22,51.79
N$1
  Top 0.254: R3.2 49.48,62.93 49.85,63.3 49.85,65.65 X6.SHIELD_4
N$2
  Top 0.203: X6.P$2 48.22,68.75 47.75,68.56 46.98,68.23 IC7.P$4
N$3
  Top 0.203: X6.P$3 48.42,69.55 47.75,69.83 47.01,70.13 IC7.P$6
N$9
  Top 0.203: STATE.C 20.27,52.55 R1.2
N$11
  Top 0.203: IC8.44 24.97,44.56 24.63,44.9 TP4.TP
N$12
  Top 0.203: IC8.1 21,42.07 TP5.TP
N$13
  Top 0.203: TP6.TP IC8.6
N$15
  Top 0.254: X6.SHIELD_3 46.53,73.2 C2.1
N$17
  Top 0.203: IC8.11 21.32,34.07 20.79,33.55 TP8.TP
N$18
  Top 0.203: IC8.21 TP9.TP
N$38
  Top 0.203: IC1.17 35.33,72.13 C7.1
N$50
  Bottom 0.203: R17.2 18.45,61.45 C41.2 22.95,61.45 R19.1
N$51
  cutout Route15: 1.27,13.21 1.27,1.27 5.33,1.27 5.33,13.21
N$59
  cutout Bottom: 1.27,13.21 1.27,1.27 5.33,1.27 5.33,13.21
N$61
  cutout Top: 1.27,13.21 1.27,1.27 5.33,1.27 5.33,13.21
N$62
  Bottom 0.203: R9.1 24.02,50.45 | 24.02,50.45 23.73,50.45 C15.1 | R4.2 24.88,48.97 24.02,49.83 24.02,50.45
N$63  (via drill 0.35)
  Top 0.203: IC8.39 28.97,42.02 v28.4,41.45
  Bottom 0.203: v28.4,41.45 29,40.85 C16.1 30.65,40.05 L3.1
N$64
  Bottom 0.203: R17.1 15.51,60.2 IC10.4 14.65,60.1 14.2,59.65 14.2,58.55 13.85,58.2 IC10.1
N$65
  Bottom 0.203: R20.1 R21.2 10.8,60.1 IC10.3
N$67
  cutout Route2: 1.27,13.21 1.27,1.27 5.33,1.27 5.33,13.21
N$68
  cutout Top: 1.27,22.86 1.27,17.53 5.33,17.53 5.33,22.86
N$69
  cutout Route2: 1.27,22.86 1.27,17.53 5.33,17.53 5.33,22.86
N$70
  cutout Route15: 1.27,22.86 1.27,17.53 5.33,17.53 5.33,22.86
N$71
  cutout Bottom: 1.27,22.86 1.27,17.53 5.33,17.53 5.33,22.86
N$73  (via drill 0.35)
  other vias: 38.61,25.91
N$103
  Top 0.203: R2.2 23.25,61.74 R5.2 21.72,65.48 20.82,66.38 X8.1
N$104
  Top 0.203: R5.1 24.55,69.09 C24.1 24.75,73.66 IC9.5
N$175
  Top 0.203: IC1.19 34.03,72.16 34.87,73 R18.2
OSC2
  Top 0.203: IC8.37 30.57,49.82 OSC1.P$3
OUTPUT0
  Top 0.254: X9.4 7.21,5.97 8.61,4.57 27.18,4.57 27.71,5.11 IC16.4
OUTPUT1
  Top 0.254: X9.5 33.66,3.43 34.19,3.96 IC15.4
PDI_CLK
  Top 0.203: R34.1 37.85,54.95 | 37.85,54.95 38.02,54.95 C13.1 38.16,54.87 SV2.5 | IC8.35 32.17,45.52 32.6,45.95 36.55,45.95 36.88,46.28 36.88,53.98 37.85,54.95
PDI_DATA
  Top 0.203: IC8.34 32.97,45.03 33.38,45.44 36.85,45.44 37.66,46.25 37.66,46.8 SV2.1
STEP_DIRECTION
  Top 0.203: X5.3 5.68,33.91 5.93,34.17 5.93,36.06 6.29,36.42 IC5.4
STEP_ENABLE
  Top 0.203: X5.2 5.56,36.45 5.81,36.71 5.81,40.01 6.55,40.74 IC6.4
STEP_PULSE
  Top 0.203: X5.4 6.1,31.37 7.09,32.36 IC4.4
U_CLOCK_IN  (via drill 0.35)
  Top 0.203: X8.4 13.57,65.23 13.96,64.83 14.78,64.49 21.34,64.49 21.93,63.89 R2.1 21.93,60.57 v21.96,60.52 | IC8.12 v21.94,32.27 v21.94,32.26
  Route2 0.203: v21.96,60.52 21.96,32.28 v21.94,32.26
  Route15 0.203: v21.96,60.52 22.19,60.29 39.33,60.29 v39.37,60.25
  Bottom 0.203: IC12.2 39.8,58.18 39.8,59.87 39.42,60.25 v39.37,60.25
U_HALL_EFFCT_IN  (via drill 0.35)
  Top 0.203: IC8.41 27.37,42.27 26.95,41.84 v26.6,41.84
  Route2 0.203: v26.6,41.84 26.6,58.05 26,58.65 v26,59.55
  Bottom 0.203: R19.2 24.85,60.2 C42.2 25.55,59.55 v26,59.55
U_PH_A  (via drill 0.35)
  Top 0.203: v19.39,29.95 26.4,29.95 26.57,30.12 IC8.14 | v16.85,49.15 16.75,49.05 IC2.4
  Bottom 0.203: v16.85,49.15 v16.86,49.14 16.86,30.58 17.48,29.95 v19.39,29.95
U_PH_B  (via drill 0.35)
  Top 0.203: IC8.15 27.37,28.64 27.02,28.28 16.07,28.28 v16.05,28.27 | v16.05,43.77 15.99,43.71 IC11.4
  Bottom 0.203: v16.05,43.77 v16.05,28.27
U_STEP_DIRECTION  (via drill 0.35)
  Top 0.203: IC8.16 28.17,33.79 27.09,34.88 v26.92,34.88 | R13.2 v15.36,35.39 14.07,35.39 IC5.2
  Route15 0.203: v26.92,34.88 v26.91,34.89 15.87,34.89 v15.36,35.39
U_STEP_ENABLE  (via drill 0.35)
  Top 0.203: IC8.13 v25.77,38.22 v25.78,38.23 | v18.54,39.24 17.91,39.88 17.01,39.88 | 17.01,39.88 16.63,39.88 R6.2 | 17.01,39.88 17.13,39.75 IC6.2
  Route15 0.203: v25.78,38.23 19.56,38.23 v18.54,39.24
U_STEP_PULSE
  Top 0.203: IC8.10 20.64,34.86 20.06,34.28 20.06,32.25 19.29,31.48 17.02,31.48 | 17.02,31.48 17.15,31.36 IC4.2 | 17.02,31.48 R12.2
UC_BRAKE  (via drill 0.35)
  Top 0.203: v24.89,37.21 23.23,37.21
  Top 0.254: IC17.2 22.61,24.75 R14.2 v24.26,24.77 | 23.23,37.21 IC8.7
  Route2 0.203: v24.25,24.77 24.25,36.57 v24.89,37.21
  Route2 0.254: v24.26,24.77 v24.25,24.77
UC_ENDSTOP
  Top 0.254: IC8.17 29.01,32.23
  Top 0.305: IC18.4 15.68,20.22 16.13,20.67 16.13,26.54 16.38,26.8 28.07,26.8 29.01,27.74 29.01,32.23
UC_INPUT0  (via drill 0.35)
  Top 0.203: IC8.25 33.64,35.67 33.02,35.05 v28.19,35.05
  Top 0.305: IC13.4 v26.95,10.95
  Bottom 0.203: v26.95,10.95 28.19,12.19 v28.19,35.05
UC_INPUT1  (via drill 0.35)
  Top 0.203: IC8.26 28.98,36.47
  Top 0.254: IC14.4 v26.95,5.87 | 28.98,36.47 v28.96,36.45
  Bottom 0.203: 28.98,36.42 28.98,6.38
  Bottom 0.254: 28.98,6.38 28.47,5.87 v26.95,5.87 | v28.96,36.45 28.98,36.42
UC_OUTPUT0  (via drill 0.35)
  Top 0.203: v26.67,38.86 26.67,38.83 23.21,38.83 IC8.5
  Top 0.254: IC16.2 28.59,22.78 R10.2 28.72,24.64 v29.97,24.64
  Route2 0.203: v29.97,24.64 27.94,24.64 27.56,25.02 27.56,37.97 v26.67,38.86
UC_OUTPUT1  (via drill 0.35)
  Top 0.203: v35.18,26.04 35.19,26.02 R11.2 | v27.69,39.12 26.33,40.47 IC8.3
  Top 0.254: IC15.2 35.18,24.62 R11.2
  Route2 0.203: v35.18,26.04 30.35,26.04 29.82,26.57 29.82,38.51 29.21,39.12 v27.69,39.12
USB_POWER  (via drill 0.35)
  Top 0.203: v46.86,69.17 46.85,69.19 IC7.P$5
  Top 0.305: L1.2 45.06,64.68 C3.1 45.16,66.61 45.63,67.08 v46.84,67.08 47.25,67.08 48.07,67.9 49.19,67.9 X6.P$1
  Bottom 0.203: v46.86,69.17 46.86,67.11 v46.84,67.08
USBDM
  Top 0.203: IC7.P$3 39.39,68.23 C4.1 36.52,68.25 35.98,68.79 IC1.16
USBDP
  Top 0.203: IC1.15 36.63,70.27 39.36,70.27 C6.1 39.5,70.13 IC7.P$1
V+  (via drill 0.35)
  Top 0.203: IC8.19 30.57,29.21 | 30.57,29.21 C28.1 | IC8.31 38.06,40.47 C26.1 | IC8.9 C29.1 18.4,35.67 v18.37,35.69 | C27.1 28.9,47.28 27.33,47.28 v27.3,47.25 | 40.15,43.12 L2.1 38.61,43.12 v38.49,43.25 | 40.15,43.12 39.84,42.81 39.84,40.72 39.58,40.47 39.12,40.47 | C26.1 39.12,40.47 | v38.1,29.21 30.57,29.21 | SV2.2 35.2,47.13 C25.1 32.78,47.15 32.78,49.82 OSC1.P$4 33.81,50.06 34.26,50.51 R34.2 | v38.81,35.69 38.81,40.16 39.12,40.47 | 40.15,43.12 39.88,43.4 39.88,43.66 39.37,44.17 v38.06,44.17 | C26.1 38.05,41.67 v38.92,42.54 v38.91,42.55 v38,42.55
  Route2 0.203: v37.04,72.11 37.08,72.07 37.08,45.16 38.49,43.74 v38.49,43.25
  Route15 0.203: v18.37,35.69 18.4,35.72 38.78,35.72 v38.81,35.69 | v38.49,43.25 37.99,43.75 27.9,43.75 27.3,44.35 v27.3,47.25 | v38.06,44.17 36.07,44.17 35.62,44.62 SV2.2 | v37.04,72.11 37.03,72.1 10.97,72.1 v10.17,71.3
  Bottom 0.203: v38.1,29.21 v38.09,29.21 38.09,40.12 38.92,40.94 v38.92,42.54 | v10.17,71.3 10.17,69.23 R8.2 | v38,42.55 38,40.7 37.65,40.35 L3.2 | R9.2 27.3,50.4 v27.3,47.25
  pour Route2: 37.5,41.89 39.33,41.89 39.33,44.68 37.5,44.68
  pour Route15: 37.5,41.89 39.33,41.89 39.33,44.68 37.5,44.68
  pour Bottom: 37.5,41.89 39.33,41.89 39.33,44.68 37.5,44.68
  pour Top: 37.5,41.89 39.33,41.89 39.33,44.68 37.5,44.68
VDD
  Bottom 0.508: X7.P1 44.54,32.42 43.43,33.53 43.43,38.77 47.17,42.51 X1.1
(copper drawn outside any net)
  shapes: Bottom area x10, Route15 area x8, Route2 area x8, Top area x26

### Text on the board
tPlace: v.1.3 H2
tNames: EMERGENCY | CLKIN | HALL EFFECT | GND / 5V / IN | ROTARY ENCODER | CLK / OUT | GND / PH_A / PH_B / N.C. / 5V | GND / / / / TX / / RX / / V+ | STEP MOTOR | GND / ENB / DIR / PULSE / 5V | 12V POWER | STEP MOTOR | GND | END / STOP / (in) | BRAKE / (out) | EXTRA IOS | GND / IN0 / IN1 / OUT0 / OUT1
tTest: camm_trigg_1 | camm_trigg_2 | lick_port_1 | lick_port_2 | reward_valve_1 | reward_valve_2 | Optical_flow_1 | Optical_flow_2